# EAGLE schematic Conception_analyse_schemas (EAGLE 9.7.0)
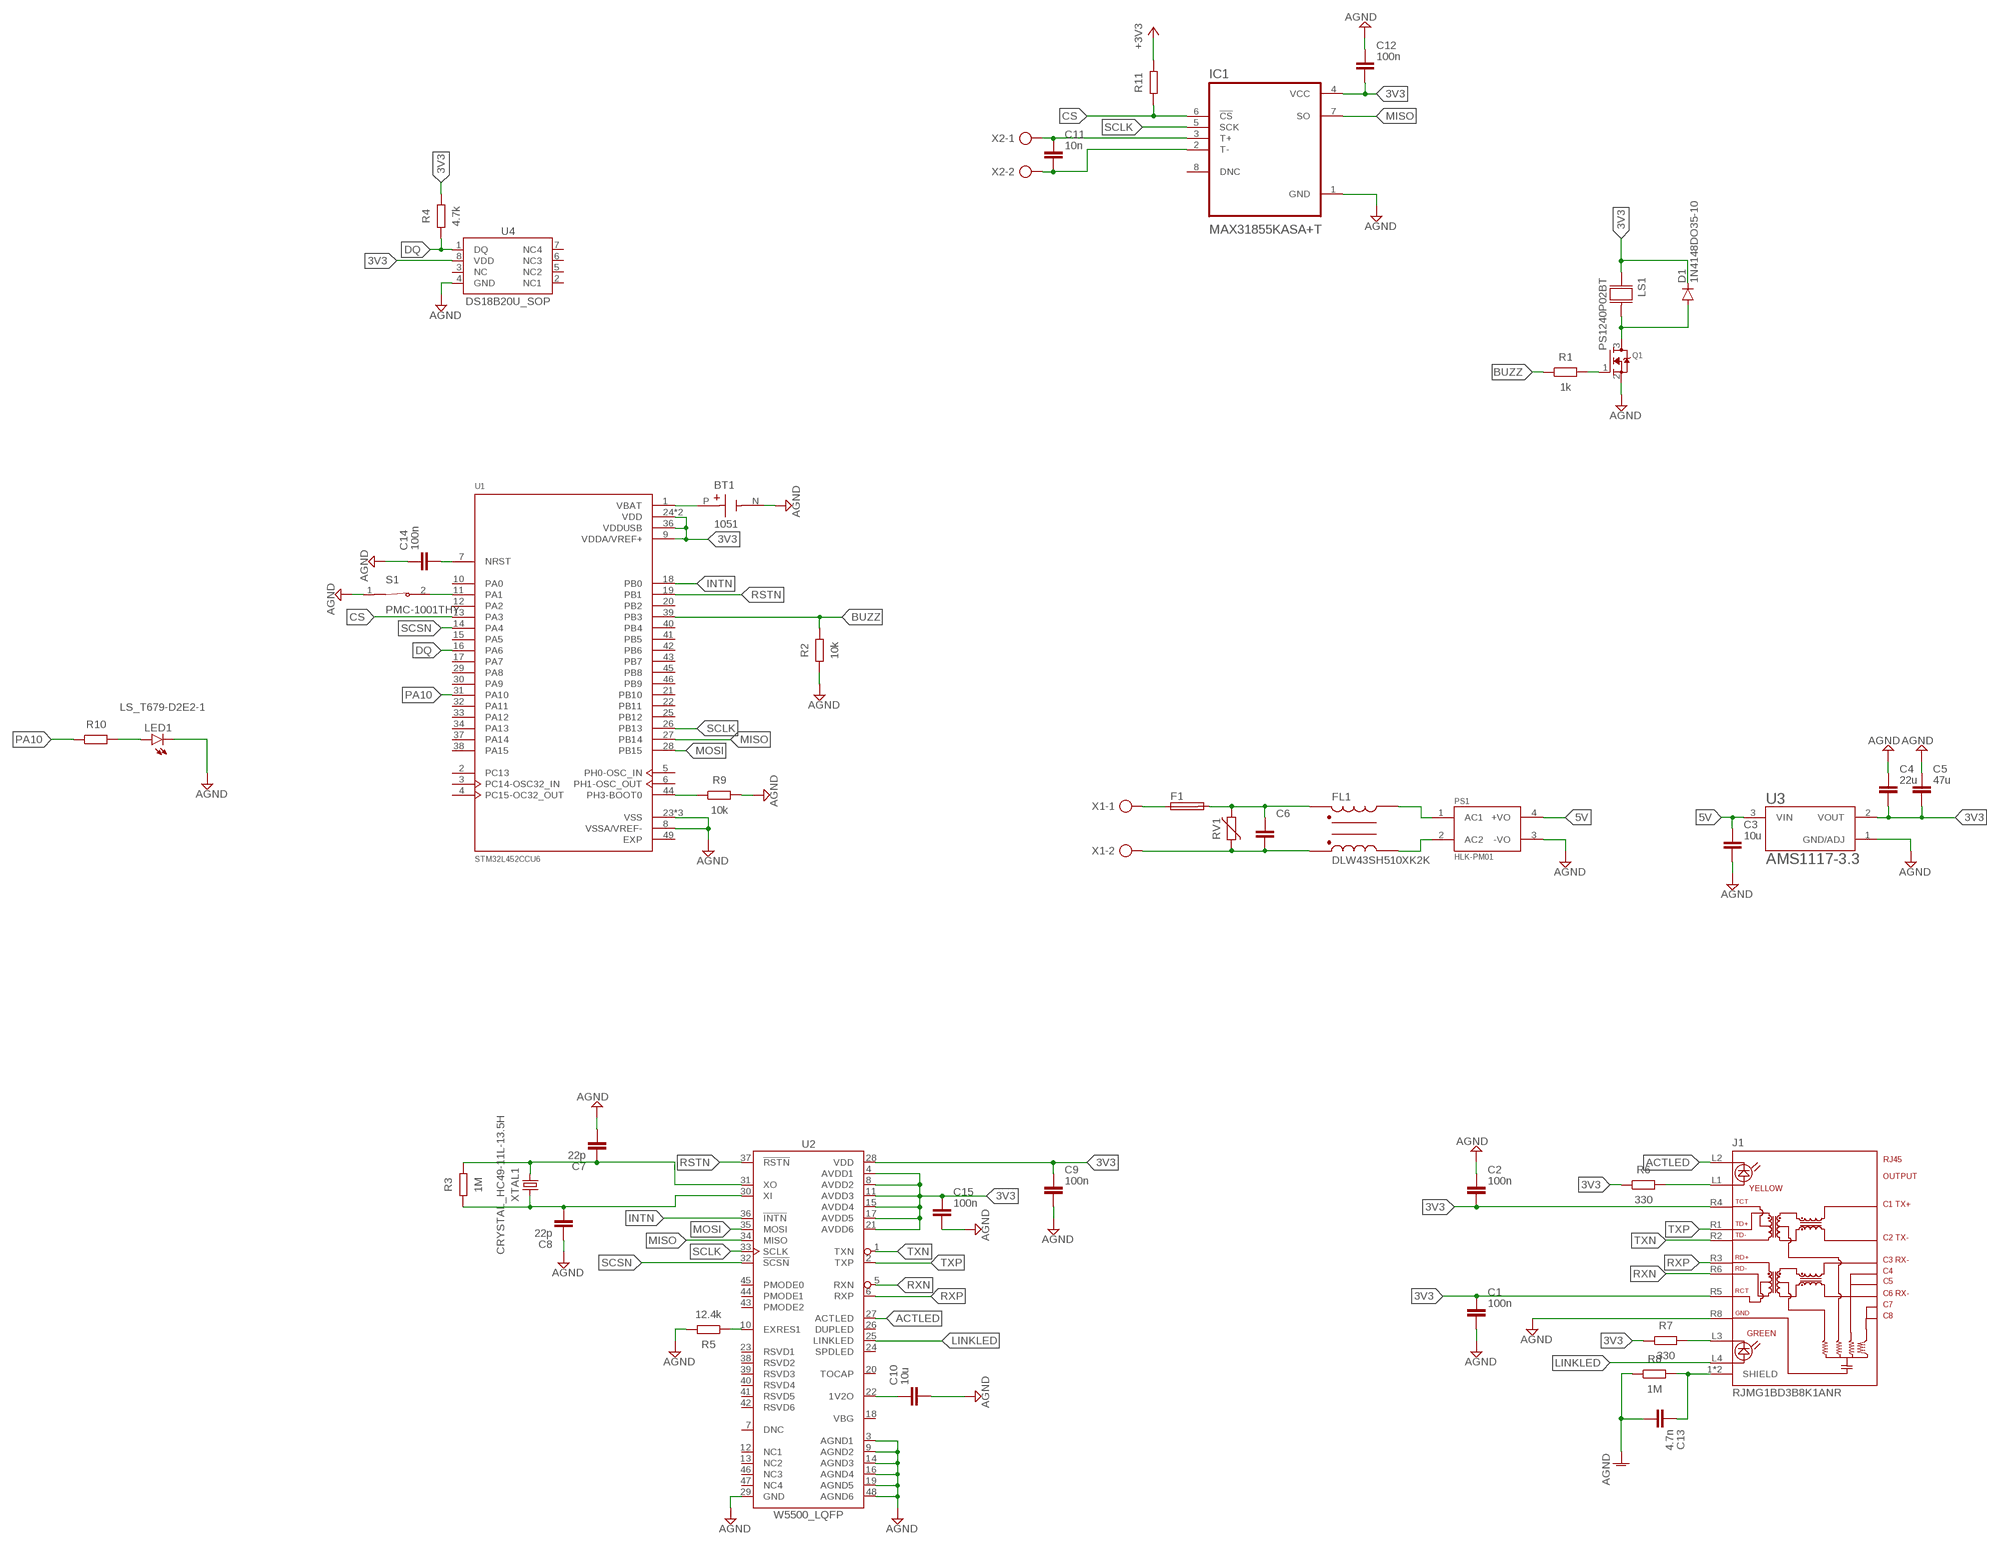
[diagram p0: schematic, sheet 1]

## Parts
BT1  1051  [BAT_1051]
C1  100n  C_CHIP-0402(1005-METRIC)  [CAPC1005X60]
C2  100n  C_CHIP-0402(1005-METRIC)  [CAPC1005X60]
C3  10u  C_CHIP-0402(1005-METRIC)  [CAPC1005X60]
C4  22u  C_CHIP-0402(1005-METRIC)  [CAPC1005X60]
C5  47u  C_CHIP-0402(1005-METRIC)  [CAPC1005X60]
C6  C_CHIP-0402(1005-METRIC)  [CAPC1005X60]
C7  22p  C_CHIP-0402(1005-METRIC)  [CAPC1005X60]
C8  22p  C_CHIP-0402(1005-METRIC)  [CAPC1005X60]
C9  100n  C_CHIP-0402(1005-METRIC)  [CAPC1005X60]
C10  10u  C_CHIP-0402(1005-METRIC)  [CAPC1005X60]
C11  10n  C_CHIP-0402(1005-METRIC)  [CAPC1005X60]
C12  100n  C_CHIP-0402(1005-METRIC)  [CAPC1005X60]
C13  4.7n  C_CHIP-0402(1005-METRIC)  [CAPC1005X60]
C14  100n  C_CHIP-0402(1005-METRIC)  [CAPC1005X60]
C15  100n  C_CHIP-0402(1005-METRIC)  [CAPC1005X60]
D1  1N4148DO35-10  [DO35-10]
F1  FUSE_AXIAL-26MM-PITCH  [FUSAD2590W70L2150D550B]
FL1  DLW43SH510XK2K  [FIL_DLW43SH510XK2K]
IC1  MAX31855KASA+T  [SOIC127P600X175-8N]
J1  RJMG1BD3B8K1ANR  [CONN_RJMG1BD3B8K1ANR]
LED1  LS_T679-D2E2-1  [PLCC2]
LS1  PS1240P02BT  [XDCR_PS1240P02BT]
PS1  HLK-PM01  [CONV_HLK-PM01]
Q1  MOSFET-NWAVE  [SOT23-W]
R1  1k  R_CHIP-0402(1005-METRIC)  [RESC1005X40]
R2  10k  R_CHIP-0402(1005-METRIC)  [RESC1005X40]
R3  1M  R_CHIP-0402(1005-METRIC)  [RESC1005X40]
R4  4.7k  R_CHIP-0402(1005-METRIC)  [RESC1005X40]
R5  12.4k  R_CHIP-0402(1005-METRIC)  [RESC1005X40]
R6  330  R_CHIP-0402(1005-METRIC)  [RESC1005X40]
R7  330  R_CHIP-0402(1005-METRIC)  [RESC1005X40]
R8  1M  R_CHIP-0402(1005-METRIC)  [RESC1005X40]
R9  10k  R_CHIP-0402(1005-METRIC)  [RESC1005X40]
R10  R_CHIP-0402(1005-METRIC)  [RESC1005X40]
R11  R_CHIP-0402(1005-METRIC)  [RESC1005X40]
RV1  VARISTOR_3216  [VARC3216X102N]
S1  PMC-1001THY  [SW_PMC-1001THY]
U1  STM32L452CCU6  [QFN50P700X700X60-49N]
U2  W5500_LQFP  [QFP50P900X900X160-48N]
U3  AMS1117-3.3  [SOT229P700X180-4N]
U4  DS18B20U_SOP  [SOP65P491X110-8N]
X1  AK300/2  [AK300/2]
X2  AK300/2  [AK300/2]
XTAL1  CRYSTAL_HC49-11L-13.5H  [XTALRR488W43L1135T465H1346B]

## Nets
3V1: C15.1
3V3: C1.1 C2.2 C4.2 C5.2 C9.1 C12.2 D1.C IC1.4(VCC) J1.R4(TCT) J1.R5(RCT) LS1.1 R4.2 R6.1 R7.1 U1.9(VDDA/VREF+) U1.24(VDD) U1.36(VDDUSB) U1.48(VDD) U2.4(AVDD1) U2.8(AVDD2) U2.11(AVDD3) U2.15(AVDD4) U2.17(AVDD5) U2.21(AVDD6) U2.28(VDD) U3.2(VOUT) U4.8(VDD)
5V: C3.1 PS1.4(+VO) U3.3(VIN)
+3V3: R11.2
ACTLED: J1.L2 U2.27(ACTLED)
AGND: BT1.N(NEG) C1.2 C2.1 C3.2 C4.1 C5.1 C7.2 C8.1 C9.2 C10.2 C12.1 C13.2 C14.1 C15.2 IC1.1(GND) J1.R8(GND) LED1.C PS1.3(-VO) Q1.2(S) R2.1 R5.2 R8.1 R9.2 S1.1(COM) U1.8(VSSA/VREF-) U1.23(VSS) U1.35(VSS) U1.47(VSS) U2.3(AGND1) U2.9(AGND2) U2.14(AGND3) U2.16(AGND4) U2.19(AGND5) U2.29(GND) U2.48(AGND6) U3.1(GND/ADJ) U4.4(GND)
BUZZ: R1.1 R2.2 U1.39(PB3)
CS: IC1.6(!CS) R11.1 U1.13(PA3)
DQ: R4.1 U1.16(PA6) U4.1(DQ)
INTN: U1.18(PB0) U2.36(!INTN)
LINKLED: J1.L4 U2.25(LINKLED)
MISO: IC1.7(SO) U1.27(PB14) U2.34(MISO)
MOSI: U1.28(PB15) U2.35(MOSI)
N$1: Q1.1(G) R1.2
N$2: F1.1 X1.1
N$3: D1.A LS1.2 Q1.3(D)
N$4: C6.1 F1.2 FL1.1 RV1.2
N$5: C6.2 FL1.4 RV1.1 X1.2
N$6: FL1.3 PS1.2(AC2)
N$7: FL1.2 PS1.1(AC1)
N$8: C7.1 R3.2 U2.31(XO) XTAL1.2
N$9: C8.2 R3.1 U2.30(XI) XTAL1.1
N$10: C10.1 U2.22(1V2O)
N$11: S1.2(NC) U1.11(PA1)
N$12: C11.1 IC1.3(T+) X2.1
N$13: BT1.P(POS) U1.1(VBAT)
N$14: R5.1 U2.10(EXRES1)
N$15: C11.2 IC1.2(T-) X2.2
N$16: J1.L1 R6.2
N$17: J1.L3 R7.2
N$18: C13.1 J1.1(SHIELD) J1.2(SHIELD) R8.2
N$19: R9.1 U1.44(PH3-BOOT0)
N$20: C14.2 U1.7(NRST)
N$21: LED1.A R10.2
PA10: R10.1 U1.31(PA10)
RSTN: U1.19(PB1) U2.37(!RSTN)
RXN: J1.R6(RD-) U2.5(RXN)
RXP: J1.R3(RD+) U2.6(RXP)
SCLK: IC1.5(SCK) U1.26(PB13) U2.33(SCLK)
SCSN: U1.14(PA4) U2.32(!SCSN)
TXN: J1.R2(TD-) U2.1(TXN)
TXP: J1.R1(TD+) U2.2(TXP)
Unconnected: IC1.8(DNC) U1.2(PC13) U1.3(PC14-OSC32_IN) U1.4(PC15-OC32_OUT) U1.5(PH0-OSC_IN) U1.6(PH1-OSC_OUT) U1.10(PA0) U1.12(PA2) U1.15(PA5) U1.17(PA7) U1.20(PB2) U1.21(PB10) U1.22(PB11) U1.25(PB12) U1.29(PA8) U1.30(PA9) U1.32(PA11) U1.33(PA12) U1.34(PA13) U1.37(PA14) U1.38(PA15) U1.40(PB4) U1.41(PB5) U1.42(PB6) U1.43(PB7) U1.45(PB8) U1.46(PB9) U2.7(DNC) U2.12(NC1) U2.13(NC2) U2.18(VBG) U2.20(TOCAP) U2.23(RSVD1) U2.24(SPDLED) U2.26(DUPLED) U2.38(RSVD2) U2.39(RSVD3) U2.40(RSVD4) U2.41(RSVD5) U2.42(RSVD6) U2.43(PMODE2) U2.44(PMODE1) U2.45(PMODE0) U2.46(NC3) U2.47(NC4) U4.2(NC1) U4.3(NC) U4.5(NC2) U4.6(NC3) U4.7(NC4)

## Power pins joined to a net without a drawn wire
EXP: U1.49(EXP)

## Library data of the parts
BT1 = 1051:1051: Check availability <https://pricing.snapeda.com/parts/1051/Keystone%20Electronics/view-part?ref=eda>
C1-C15 = Tutorial - Fusion 360:C: Capacitor - Generic
D1 = diode:1N4148: DIODE high speed (Philips)
F1 = Circuit-Protection:FUSE: Fuse - Generic
FL1 = DLW43SH510XK2K:DLW43SH510XK2K: Check availability <https://pricing.snapeda.com/parts/DLW43SH510XK2K/Murata/view-part?ref=eda>
IC1 = MAX31855KASA_T:MAX31855KASA+T: Check availability <https://pricing.snapeda.com/parts/MAX31855KASA%2BT/Analog%20Devices/view-part?ref=eda>
J1 = RJMG1BD3B8K1ANR:RJMG1BD3B8K1ANR: Check availability <https://pricing.snapeda.com/parts/RJMG1BD3B8K1ANR/FCI/view-part?ref=eda>
LED1 = led:*_T679-?-1: LC TOPLED® Low Current LED Source: http://catalog.osram-os.com .. LG_LS_LY_T679_OBS.pdf
LS1 = PS1240P02BT:PS1240P02BT: Check availability <https://pricing.snapeda.com/parts/PS1240P02BT/TDK%20Corporation/view-part?ref=eda>
PS1 = HLK-PM01:HLK-PM01: Check availability <https://pricing.snapeda.com/parts/hlk-pm01/Hi-link/view-part?ref=eda>
Q1 = adafruit:MOSFET-N: N-Channel Mosfet 2N7002E - 60V 260mA SOT23 [Digikey: 2N7002ET1GOSTR-ND] - REEL BSH103 - 30V 850mA SOT23 [Digikey: 568-5013-1-ND]
R1-R11 = Resistor:R: Resistor Fixed - Generic
RV1 = Circuit-Protection:VARISTOR: Varistor - Generic
S1 = PMC-1001THY:PMC-1001THY: Check availability <https://pricing.snapeda.com/parts/PMC-1001THY/PIC%20GmbH/view-part?ref=eda>
U1 = STM32L452CCU6:STM32L452CCU6: Check availability <https://pricing.snapeda.com/parts/STM32L452CCU6/STMicroelectronics/view-part?ref=eda>
U2 = IC_Interface:W5500: Ethernet Controller 10/100 Base-T/TX PHY SPI Interface 48-LQFP (7x7) Datasheet <https://cdn.sparkfun.com/datasheets/Dev/Arduino/Shields/W5500_datasheet_v1.0.2_1.pdf>
U3 = AMS1117-3.3:AMS1117-3.3: Check availability <https://pricing.snapeda.com/parts/AMS1117-3.3/Advanced%20Monolithic%20Systems/view-part?ref=eda>
U4 = Sensor:DS18B20U: Programmable Resolution 1-Wire Digital Thermometer.
X1 X2 = con-ptr500:AK300/2: CONNECTOR
XTAL1 = Frequency-Source:CRYSTAL: Crystal 2Pin - Generic